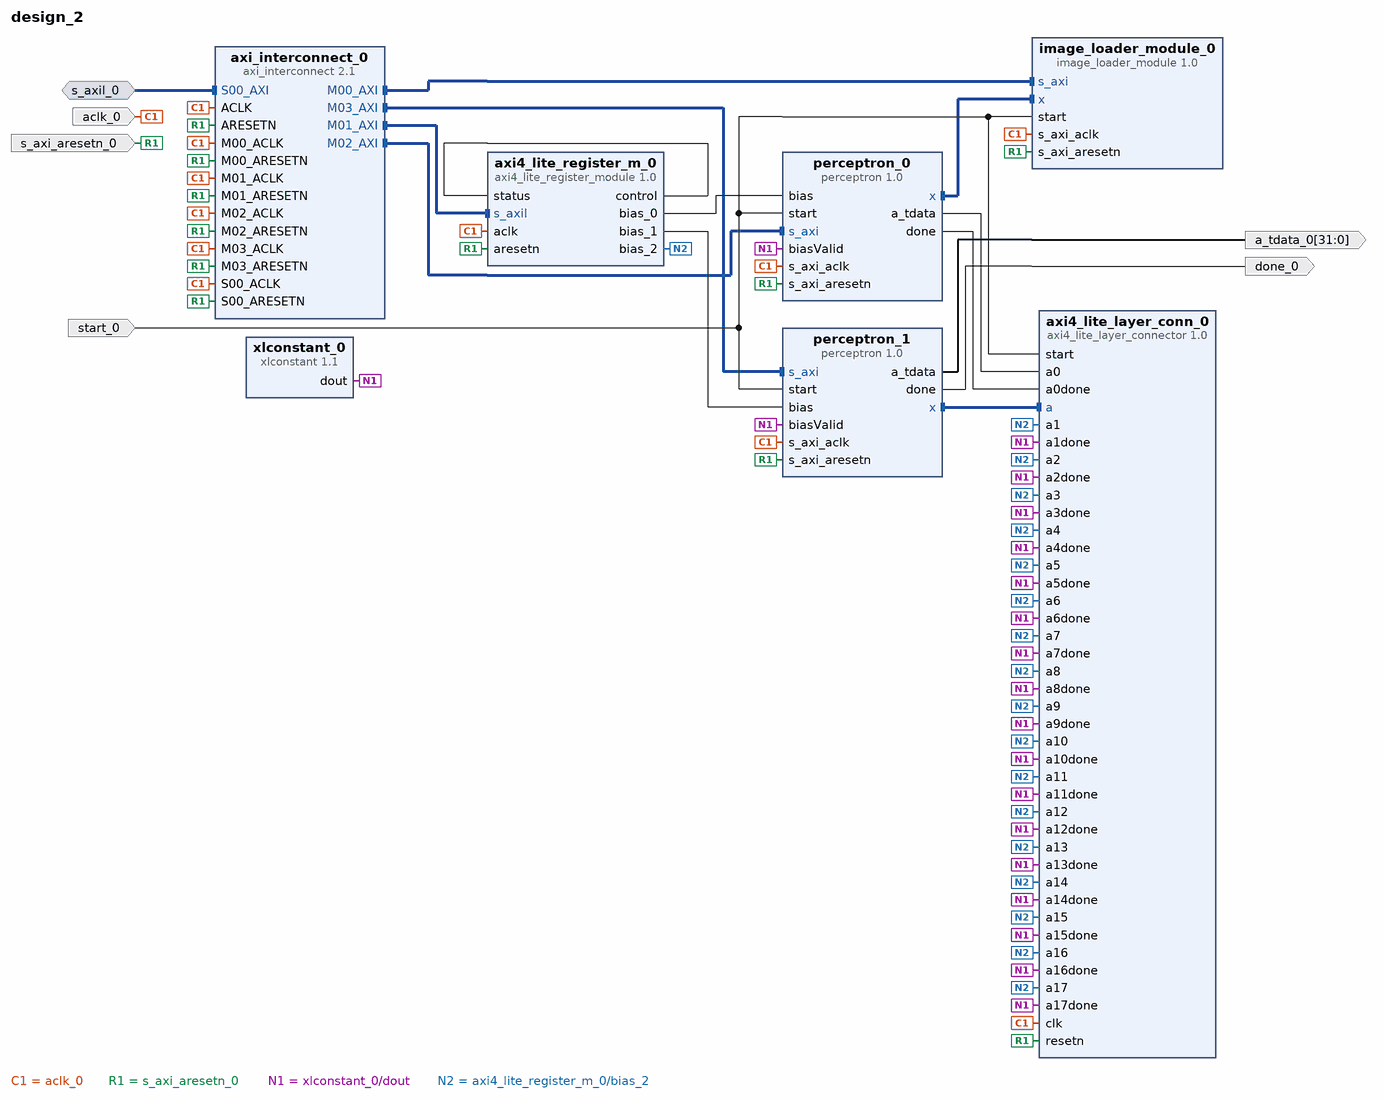
[diagram p0: block diagram of the top level]
# Vivado block design design_2, xc7z010clg400-1, Vivado 2019.2
create_bd_design design_2

create_bd_intf_port -mode Slave -vlnv xilinx.com:interface:aximm_rtl:1.0 s_axil_0
set_property -dict [list \
  CONFIG.DATA_WIDTH 32 \
  CONFIG.PROTOCOL AXI4LITE \
  CONFIG.ID_WIDTH 0 \
  CONFIG.ADDR_WIDTH 32 \
  CONFIG.AWUSER_WIDTH 0 \
  CONFIG.ARUSER_WIDTH 0 \
  CONFIG.WUSER_WIDTH 0 \
  CONFIG.RUSER_WIDTH 0 \
  CONFIG.BUSER_WIDTH 0 \
  CONFIG.READ_WRITE_MODE READ_WRITE \
  CONFIG.HAS_BURST 1 \
  CONFIG.HAS_LOCK 1 \
  CONFIG.HAS_PROT 1 \
  CONFIG.HAS_CACHE 1 \
  CONFIG.HAS_QOS 1 \
  CONFIG.HAS_REGION 0 \
  CONFIG.HAS_WSTRB 1 \
  CONFIG.HAS_BRESP 1 \
  CONFIG.HAS_RRESP 1 \
  CONFIG.SUPPORTS_NARROW_BURST 0 \
  CONFIG.NUM_READ_OUTSTANDING 2 \
  CONFIG.NUM_WRITE_OUTSTANDING 2 \
  CONFIG.MAX_BURST_LENGTH 1 \
  CONFIG.NUM_READ_THREADS 1 \
  CONFIG.NUM_WRITE_THREADS 1 \
  CONFIG.RUSER_BITS_PER_BYTE 0 \
  CONFIG.WUSER_BITS_PER_BYTE 0 \
] [get_bd_intf_ports s_axil_0]
create_bd_port -dir I start_0
create_bd_port -dir I -type clk aclk_0
create_bd_port -dir I -type rst s_axi_aresetn_0
create_bd_port -dir O -from 31 -to 0 a_tdata_0
create_bd_port -dir O done_0

create_bd_cell -type ip -vlnv xilinx.com:user:axi4_lite_register_module:1.0 axi4_lite_register_m_0
create_bd_cell -type ip -vlnv xilinx.com:ip:axi_interconnect:2.1 axi_interconnect_0
set_property -dict {CONFIG.NUM_MI 4} [get_bd_cells axi_interconnect_0]
create_bd_cell -type ip -vlnv xilinx.com:ip:xlconstant:1.1 xlconstant_0
create_bd_cell -type ip -vlnv xilinx.com:user:perceptron:1.0 perceptron_0
create_bd_cell -type ip -vlnv xilinx.com:user:perceptron:1.0 perceptron_1
set_property -dict {CONFIG.input_size 18} [get_bd_cells perceptron_1]
create_bd_cell -type ip -vlnv xilinx.com:user:image_loader_module:1.0 image_loader_module_0
create_bd_cell -type ip -vlnv xilinx.com:user:axi4_lite_layer_connector:1.0 axi4_lite_layer_conn_0

# ---- connections ----

connect_bd_intf_net -intf_net S00_AXI_0_1 [get_bd_intf_ports s_axil_0] [get_bd_intf_pins axi_interconnect_0/S00_AXI]
connect_bd_intf_net [get_bd_intf_pins perceptron_1/s_axi] [get_bd_intf_pins axi_interconnect_0/M03_AXI]
connect_bd_intf_net [get_bd_intf_pins perceptron_1/x] [get_bd_intf_pins axi4_lite_layer_conn_0/a]
connect_bd_intf_net [get_bd_intf_pins perceptron_0/s_axi] [get_bd_intf_pins axi_interconnect_0/M02_AXI]
connect_bd_intf_net [get_bd_intf_pins perceptron_0/x] [get_bd_intf_pins image_loader_module_0/x]
connect_bd_intf_net [get_bd_intf_pins image_loader_module_0/s_axi] [get_bd_intf_pins axi_interconnect_0/M00_AXI]
connect_bd_intf_net [get_bd_intf_pins axi4_lite_register_m_0/s_axil] [get_bd_intf_pins axi_interconnect_0/M01_AXI]
connect_bd_net [get_bd_pins axi4_lite_register_m_0/bias_0] [get_bd_pins perceptron_0/bias]
connect_bd_net [get_bd_pins axi4_lite_register_m_0/control] [get_bd_pins axi4_lite_register_m_0/status]
connect_bd_net -net start_0_1 [get_bd_ports start_0] \
  [get_bd_pins perceptron_0/start] [get_bd_pins perceptron_1/start] [get_bd_pins image_loader_module_0/start] \
  [get_bd_pins axi4_lite_layer_conn_0/start]
connect_bd_net -net M02_ACLK_0_1 [get_bd_ports aclk_0] \
  [get_bd_pins axi_interconnect_0/M02_ACLK] [get_bd_pins axi4_lite_register_m_0/aclk] \
  [get_bd_pins axi_interconnect_0/M01_ACLK] [get_bd_pins axi_interconnect_0/M00_ACLK] \
  [get_bd_pins axi_interconnect_0/S00_ACLK] [get_bd_pins axi_interconnect_0/ACLK] [get_bd_pins axi_interconnect_0/M03_ACLK] \
  [get_bd_pins perceptron_0/s_axi_aclk] [get_bd_pins perceptron_1/s_axi_aclk] [get_bd_pins image_loader_module_0/s_axi_aclk] \
  [get_bd_pins axi4_lite_layer_conn_0/clk]
connect_bd_net -net M02_ARESETN_0_1 [get_bd_ports s_axi_aresetn_0] \
  [get_bd_pins axi_interconnect_0/M02_ARESETN] [get_bd_pins axi4_lite_register_m_0/aresetn] \
  [get_bd_pins axi_interconnect_0/M01_ARESETN] [get_bd_pins axi_interconnect_0/M00_ARESETN] \
  [get_bd_pins axi_interconnect_0/S00_ARESETN] [get_bd_pins axi_interconnect_0/ARESETN] \
  [get_bd_pins axi_interconnect_0/M03_ARESETN] [get_bd_pins perceptron_0/s_axi_aresetn] \
  [get_bd_pins perceptron_1/s_axi_aresetn] [get_bd_pins image_loader_module_0/s_axi_aresetn] \
  [get_bd_pins axi4_lite_layer_conn_0/resetn]
connect_bd_net [get_bd_pins xlconstant_0/dout] \
  [get_bd_pins perceptron_0/biasValid] [get_bd_pins perceptron_1/biasValid] [get_bd_pins axi4_lite_layer_conn_0/a1done] \
  [get_bd_pins axi4_lite_layer_conn_0/a2done] [get_bd_pins axi4_lite_layer_conn_0/a3done] \
  [get_bd_pins axi4_lite_layer_conn_0/a4done] [get_bd_pins axi4_lite_layer_conn_0/a5done] \
  [get_bd_pins axi4_lite_layer_conn_0/a6done] [get_bd_pins axi4_lite_layer_conn_0/a7done] \
  [get_bd_pins axi4_lite_layer_conn_0/a8done] [get_bd_pins axi4_lite_layer_conn_0/a9done] \
  [get_bd_pins axi4_lite_layer_conn_0/a10done] [get_bd_pins axi4_lite_layer_conn_0/a11done] \
  [get_bd_pins axi4_lite_layer_conn_0/a12done] [get_bd_pins axi4_lite_layer_conn_0/a13done] \
  [get_bd_pins axi4_lite_layer_conn_0/a14done] [get_bd_pins axi4_lite_layer_conn_0/a15done] \
  [get_bd_pins axi4_lite_layer_conn_0/a16done] [get_bd_pins axi4_lite_layer_conn_0/a17done]
connect_bd_net [get_bd_pins perceptron_0/a_tdata] [get_bd_pins axi4_lite_layer_conn_0/a0]
connect_bd_net [get_bd_pins perceptron_0/done] [get_bd_pins axi4_lite_layer_conn_0/a0done]
connect_bd_net [get_bd_pins axi4_lite_register_m_0/bias_1] [get_bd_pins perceptron_1/bias]
connect_bd_net [get_bd_pins perceptron_1/a_tdata] [get_bd_ports a_tdata_0]
connect_bd_net [get_bd_pins perceptron_1/done] [get_bd_ports done_0]
connect_bd_net [get_bd_pins axi4_lite_register_m_0/bias_2] \
  [get_bd_pins axi4_lite_layer_conn_0/a1] [get_bd_pins axi4_lite_layer_conn_0/a2] [get_bd_pins axi4_lite_layer_conn_0/a3] \
  [get_bd_pins axi4_lite_layer_conn_0/a4] [get_bd_pins axi4_lite_layer_conn_0/a5] [get_bd_pins axi4_lite_layer_conn_0/a6] \
  [get_bd_pins axi4_lite_layer_conn_0/a7] [get_bd_pins axi4_lite_layer_conn_0/a8] [get_bd_pins axi4_lite_layer_conn_0/a9] \
  [get_bd_pins axi4_lite_layer_conn_0/a10] [get_bd_pins axi4_lite_layer_conn_0/a11] [get_bd_pins axi4_lite_layer_conn_0/a12] \
  [get_bd_pins axi4_lite_layer_conn_0/a13] [get_bd_pins axi4_lite_layer_conn_0/a14] [get_bd_pins axi4_lite_layer_conn_0/a15] \
  [get_bd_pins axi4_lite_layer_conn_0/a16] [get_bd_pins axi4_lite_layer_conn_0/a17]

# ---- address map ----
assign_bd_address -offset 0x00000000 -range 128 -target_address_space [get_bd_addr_spaces s_axil_0] [get_bd_addr_segs axi4_lite_register_m_0/s_axil/reg0]
assign_bd_address -offset 0x40000000 -range 4K -target_address_space [get_bd_addr_spaces s_axil_0] [get_bd_addr_segs image_loader_module_0/S_AXI/reg0]
assign_bd_address -offset 0x50000000 -range 4K -target_address_space [get_bd_addr_spaces s_axil_0] [get_bd_addr_segs perceptron_1/s_axi/reg0]
assign_bd_address -offset 0x80000000 -range 4K -target_address_space [get_bd_addr_spaces s_axil_0] [get_bd_addr_segs perceptron_0/s_axi/reg0]

validate_bd_design
save_bd_design
